# EAGLE design nes_snes_simple (EAGLE 6.4)
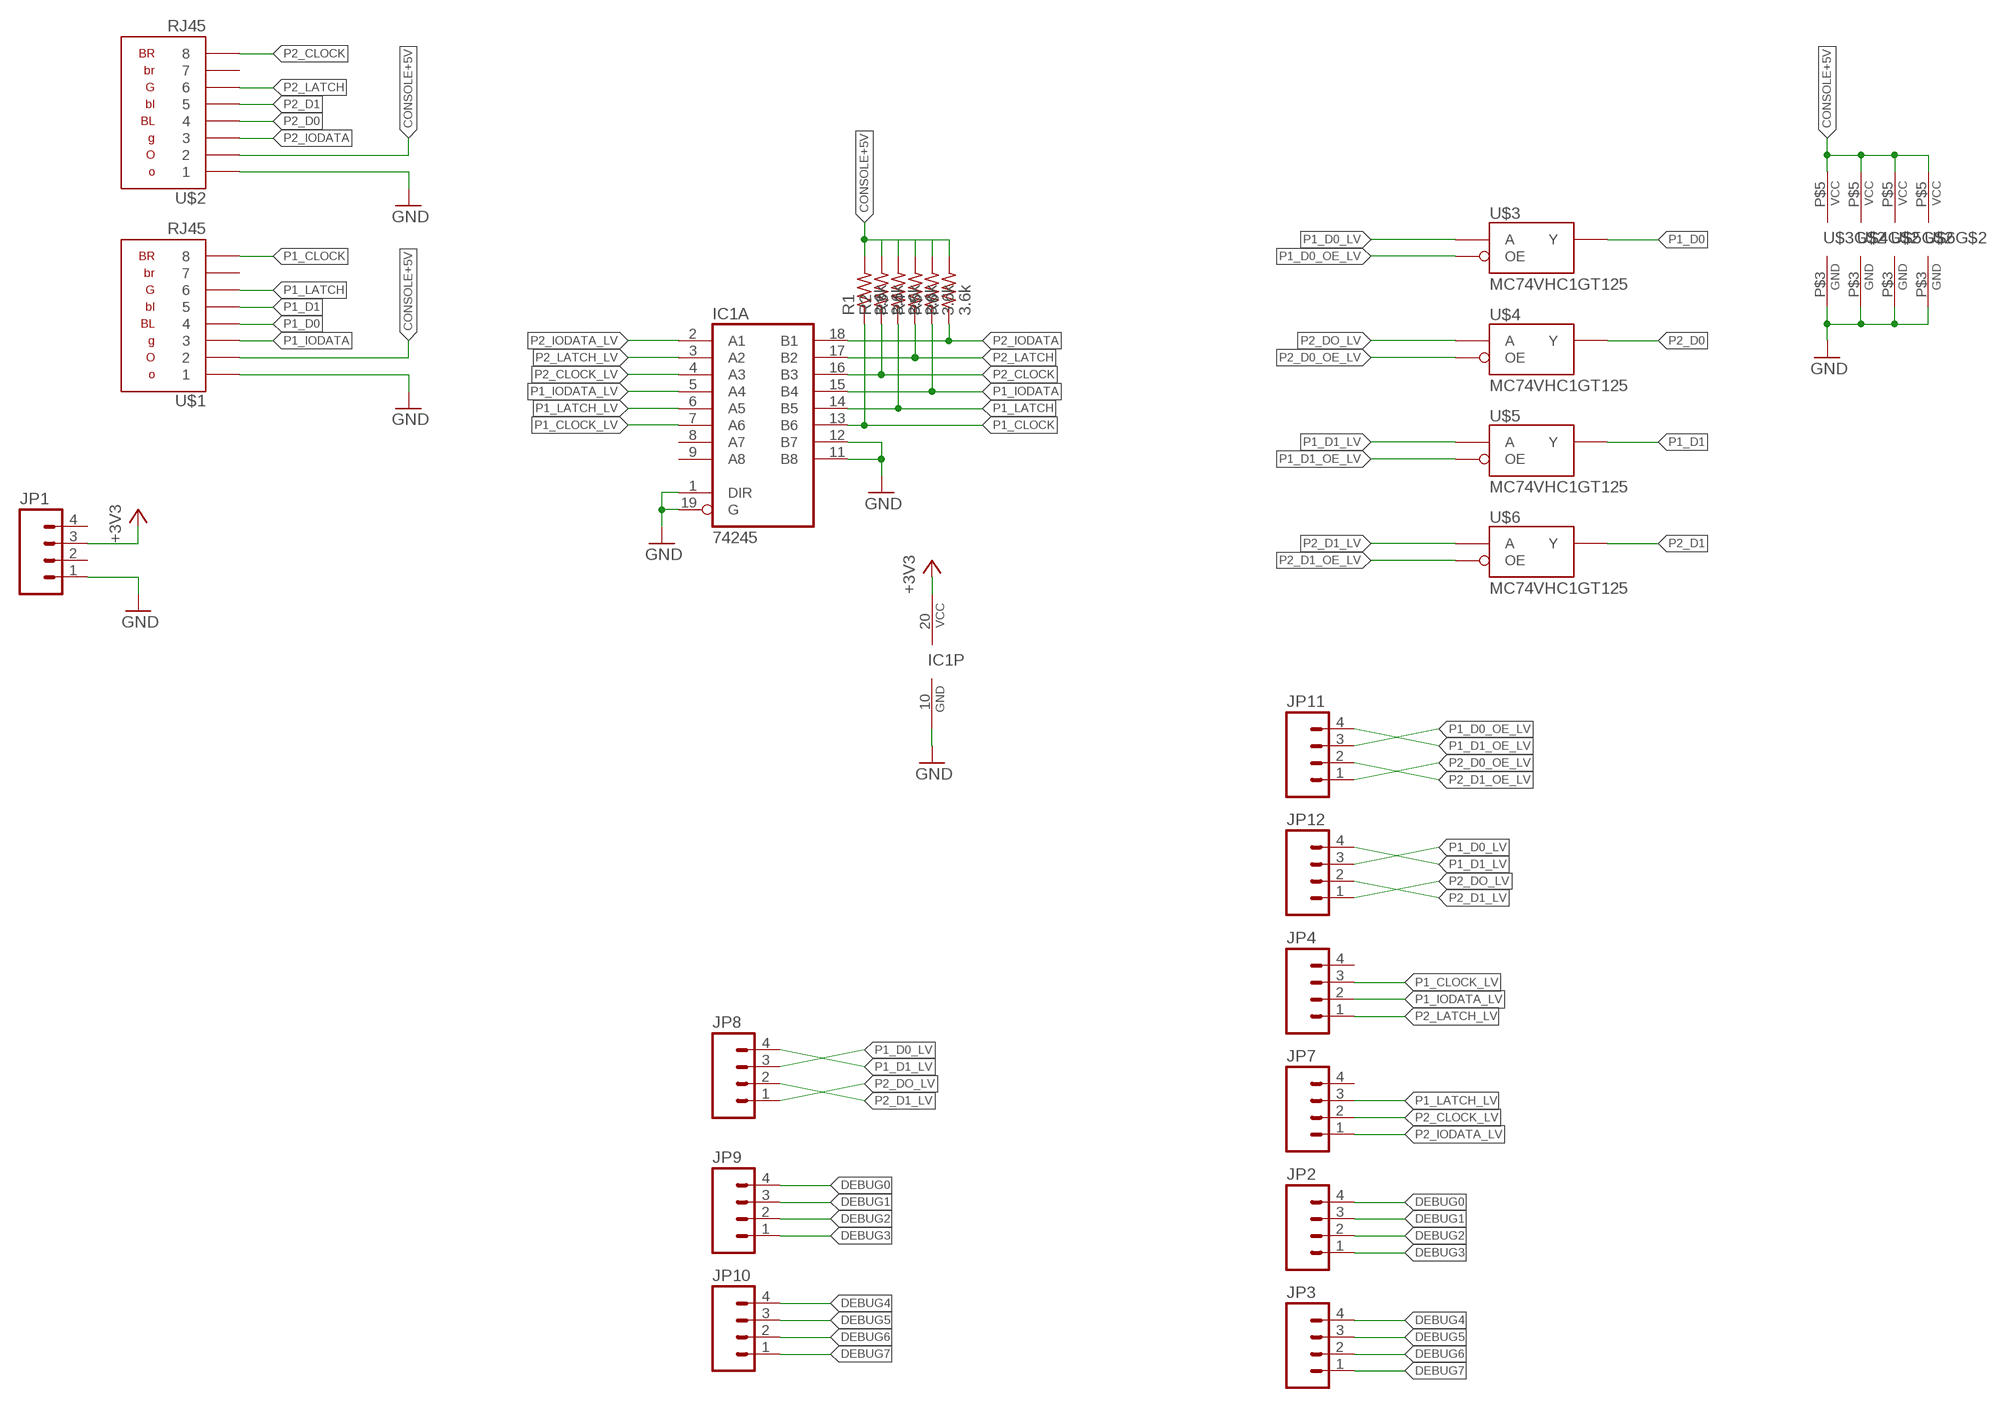
[diagram p0: schematic, sheet 1]

## Parts
IC1  74245  [DIL20]
JP1  M04PTH  [1X04]
JP2  M04PTH  [1X04]
JP3  M04PTH  [1X04]
JP4  M04PTH  [1X04]
JP7  M04PTH  [1X04]
JP8  M04PTH  [1X04]
JP9  M04PTH  [1X04]
JP10  M04PTH  [1X04]
JP11  M04PTH  [1X04]
JP12  M04PTH  [1X04]
R1  3.6k  R-US_0207/2V  [0207/2V]
R2  3.6k  R-US_0207/2V  [0207/2V]
R3  3.6k  R-US_0207/2V  [0207/2V]
R4  3.6k  R-US_0207/2V  [0207/2V]
R5  3.6k  R-US_0207/2V  [0207/2V]
R6  3.6k  R-US_0207/2V  [0207/2V]
U$1  RJ45  [RJ45]
U$2  RJ45  [RJ45]
U$3  MC74VHC1GT125  [TSOP-5]
U$4  MC74VHC1GT125  [TSOP-5]
U$5  MC74VHC1GT125  [TSOP-5]
U$6  MC74VHC1GT125  [TSOP-5]

## Nets
+3V3: IC1.20(VCC) JP1.3
CONSOLE+5V: R1.2 R2.2 R3.2 R4.2 R5.2 R6.2 U$1.2 U$2.2 U$3.P$5(VCC) U$4.P$5(VCC) U$5.P$5(VCC) U$6.P$5(VCC)
DEBUG0: JP2.4 JP9.4
DEBUG1: JP2.3 JP9.3
DEBUG2: JP2.2 JP9.2
DEBUG3: JP2.1 JP9.1
DEBUG4: JP3.4 JP10.4
DEBUG5: JP3.3 JP10.3
DEBUG6: JP3.2 JP10.2
DEBUG7: JP3.1 JP10.1
GND: IC1.1(DIR) IC1.10(GND) IC1.11(B8) IC1.12(B7) IC1.19(G) JP1.1 U$1.1 U$2.1 U$3.P$3(GND) U$4.P$3(GND) U$5.P$3(GND) U$6.P$3(GND)
P1_CLOCK: IC1.13(B6) R1.1 U$1.8
P1_CLOCK_LV: IC1.7(A6) JP4.3
P1_D0: U$1.4 U$3.P$4(Y)
P1_D0_LV: JP8.3 JP12.3 U$3.P$2(A)
P1_D0_OE_LV: JP11.3 U$3.P$1(OE)
P1_D1: U$1.5 U$5.P$4(Y)
P1_D1_LV: JP8.4 JP12.4 U$5.P$2(A)
P1_D1_OE_LV: JP11.4 U$5.P$1(OE)
P1_IODATA: IC1.15(B4) R5.1 U$1.3
P1_IODATA_LV: IC1.5(A4) JP4.2
P1_LATCH: IC1.14(B5) R3.1 U$1.6
P1_LATCH_LV: IC1.6(A5) JP7.3
P2_CLOCK: IC1.16(B3) R2.1 U$2.8
P2_CLOCK_LV: IC1.4(A3) JP7.2
P2_D0: U$2.4 U$4.P$4(Y)
P2_D0_OE_LV: JP11.1 U$4.P$1(OE)
P2_D1: U$2.5 U$6.P$4(Y)
P2_D1_LV: JP8.2 JP12.2 U$6.P$2(A)
P2_D1_OE_LV: JP11.2 U$6.P$1(OE)
P2_DO_LV: JP8.1 JP12.1 U$4.P$2(A)
P2_IODATA: IC1.18(B1) R6.1 U$2.3
P2_IODATA_LV: IC1.2(A1) JP7.1
P2_LATCH: IC1.17(B2) R4.1 U$2.6
P2_LATCH_LV: IC1.3(A2) JP4.1
Unconnected: IC1.8(A7) IC1.9(A8) JP1.2 JP1.4 JP4.4 JP7.4 U$1.7 U$2.7

## Library data of the parts
IC1 = TASLink:74245
JP1-JP4 JP7-JP12 = SparkFun-Connectors:M04: Header 4 Standard 4-pin 0.1" header. Use with straight break away headers (SKU : PRT-00116), right angle break away headers (PRT-00553), swiss pins (PRT-00743), machine pins (PRT-00117), and female headers (PRT-00115). Molex polarized connector foot print use with SKU : PRT-08231 with associated crimp pins and housings. 1MM SMD Version SKU: PRT-10208
R1-R6 = rcl:R-US_: RESISTOR, American symbol
U$1 U$2 = TASLink:RJ45
U$3-U$6 = TASLink:MC74VHC1GT125

## Board
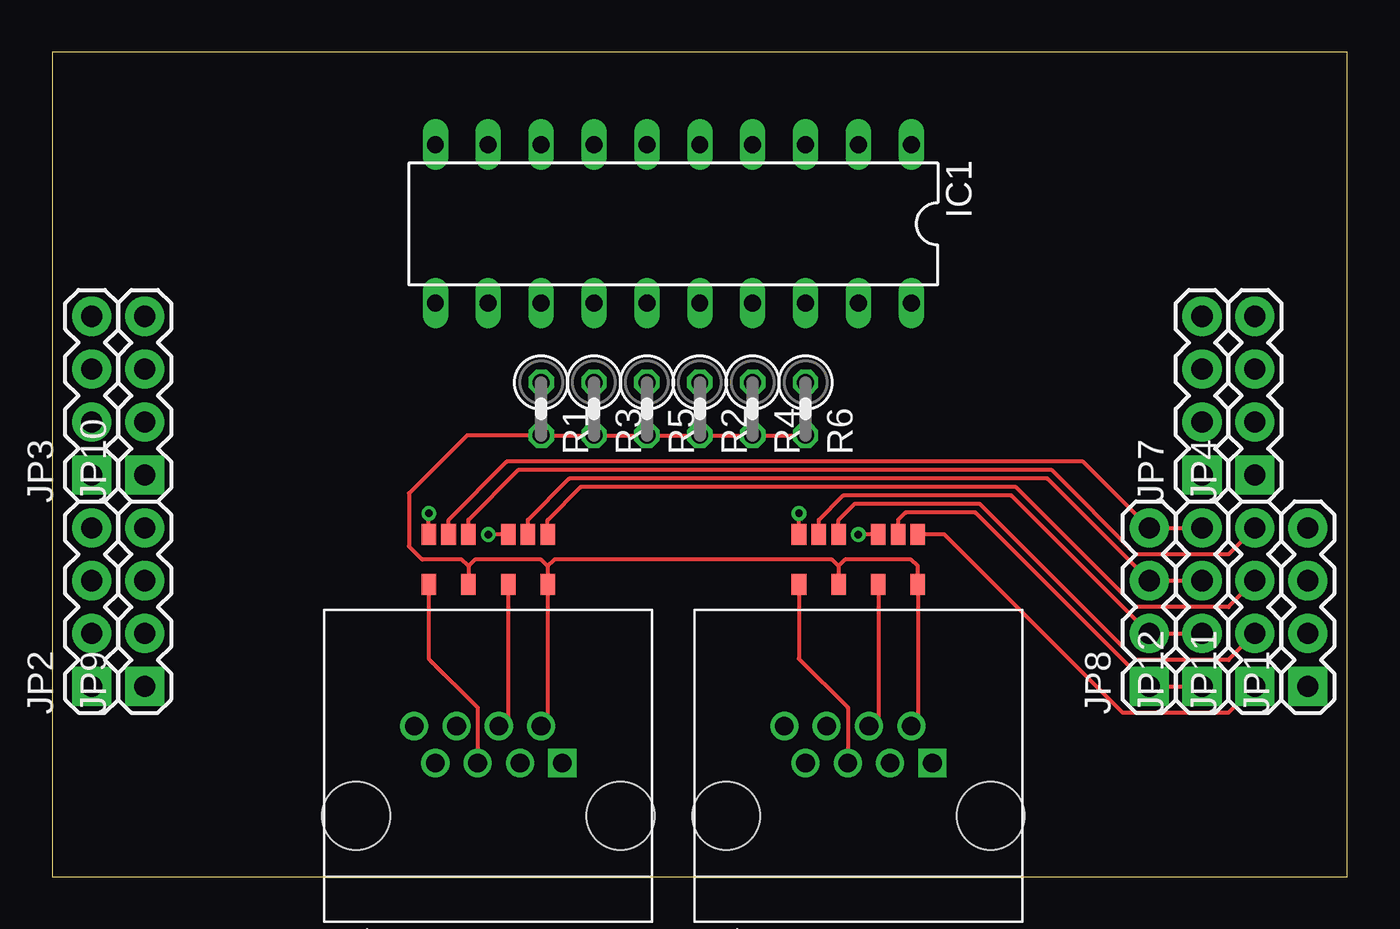
[diagram p1: board, top side]
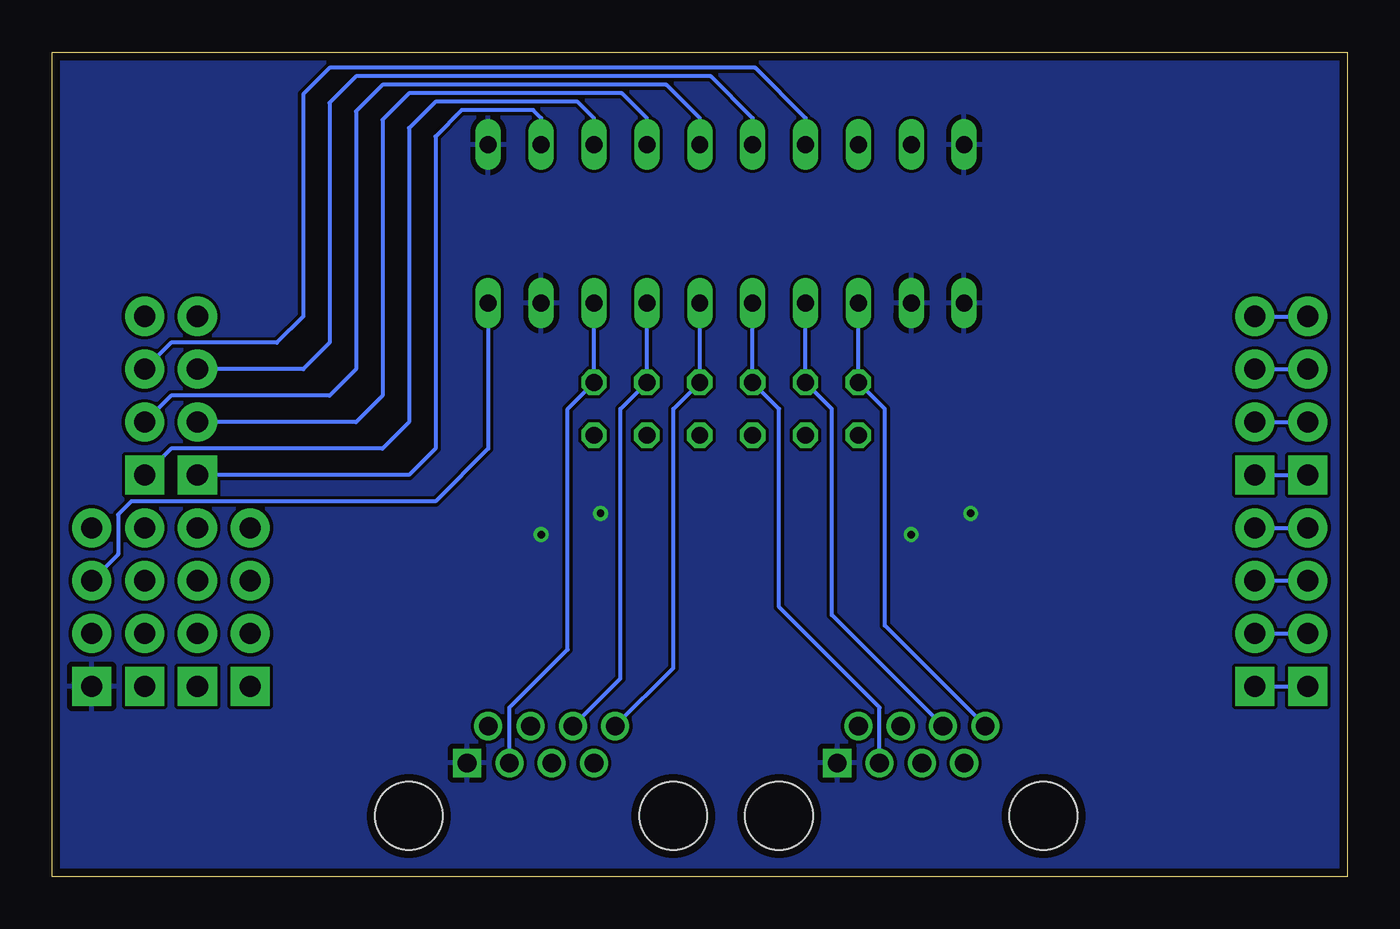
[diagram p2: board, bottom side, seen from below]

Size 62.23 x 39.62 mm. Coordinates in mm from the lower left corner, seen from the top.
Outline: 0,0 62.23,0 62.23,39.62 0,39.62 0,0
Copper layers (1*16): Top 0.0356mm / dielectric 1.5011mm / Bottom 0.0356mm
Design rules "LaenPCBOrder *": minimum track width 6mil, minimum drill 13mil, track to track 6mil, track to pad 6mil, pad to pad 6mil, via to via 6mil, smd to smd 6mil, copper to edge 15mil, drill to drill 6mil, minimum pad ring 7mil, minimum via ring 7mil, stop-mask expansion 3mil, vias tented up to drill 0mil, thermal gap 10mil

### Footprints (pad centres in the part's own frame; a part is rotated, then mirrored left to right if it is on the bottom)
DIL20 = drill 0.813 long: 1 -11.43,-3.81; 2 -8.89,-3.81; 3 -6.35,-3.81; 4 -3.81,-3.81; 5 -1.27,-3.81; 6 1.27,-3.81; 7 3.81,-3.81; 8 6.35,-3.81; 9 8.89,-3.81; 10 11.43,-3.81; 11 11.43,3.81; 12 8.89,3.81; 13 6.35,3.81; 14 3.81,3.81; 15 1.27,3.81; 16 -1.27,3.81; 17 -3.81,3.81; 18 -6.35,3.81; 19 -8.89,3.81; 20 -11.43,3.81
1X04 = drill 1.016 pad 1.88 square: 1 0,0 | drill 1.016 pad 1.88: 2 2.54,0; 3 5.08,0; 4 7.62,0
0207/2V = drill 0.813 octagon: 1 -1.27,0; 2 1.27,0
RJ45 = drill 0.9 square: 1 3.556,-0.889 | drill 0.9: 2 2.54,0.889; 3 1.524,-0.889; 4 0.508,0.889; 5 -0.508,-0.889; 6 -1.524,0.889; 7 -2.54,-0.889; 8 -3.556,0.889 | hole 3.251: -6.35,-3.429; 6.35,-3.429
TSOP-5 = smd 0.7 x 1: P$1 0.95,1.2; P$2 0,1.2; P$3 -0.95,1.2; P$4 -0.95,-1.2; P$5 0.95,-1.2

### Placement (x,y rotation side)
IC1  29.84,31.37 180 top
JP1  60.33,9.14 90 top
JP2  1.91,9.14 90 top
JP3  1.91,19.3 90 top
JP4  57.78,19.3 90 top
JP7  55.24,19.3 90 top
JP8  52.7,9.14 90 top
JP9  4.45,9.14 90 top
JP10  4.45,19.3 90 top
JP11  57.78,9.14 90 top
JP12  55.24,9.14 90 top
R1  23.5,22.48 270 top
R2  31.11,22.48 270 top
R3  26.04,22.48 270 top
R4  33.66,22.48 270 top
R5  28.57,22.48 270 top
R6  36.2,22.48 270 top
U$1  20.95,6.35 0 top
U$2  38.73,6.35 0 top
U$3  22.86,15.24 0 top
U$4  40.64,15.24 0 top
U$5  19.05,15.24 0 top
U$6  36.83,15.24 0 top

### Tracks (layer width: path | path; a pad name or v marks a point on that pad's centre or on a via)
+3V3
  Bottom 0.203: IC1.20 41.27,20.57 43.81,18.03 58.42,18.03 59.05,17.4 59.05,15.49 JP1.3
CONSOLE+5V
  Top 0.203: R6.2 R4.2 R2.2 R5.2 R3.2 R1.2 19.94,21.21 17.14,18.41 17.14,15.88 17.78,15.24 19.68,15.24 20,14.92 | 23.81,14.92 23.49,15.24 20.32,15.24 20,14.92 | 37.78,14.92 38.1,15.24 41.27,15.24 41.59,14.92 U$4.P$5 41.59,7.55 U$2.2 | 20,14.92 U$5.P$5 | U$1.2 23.81,7.55 U$3.P$5 23.81,14.92 | 23.81,14.92 24.13,15.24 37.46,15.24 37.78,14.92 | 37.78,14.92 U$6.P$5
DEBUG0
  Bottom 0.203: JP9.4 JP2.4
DEBUG1
  Bottom 0.203: JP9.3 JP2.3
DEBUG2
  Bottom 0.203: JP9.2 JP2.2
DEBUG3
  Bottom 0.203: JP9.1 JP2.1
DEBUG4
  Bottom 0.203: JP10.4 JP3.4
DEBUG5
  Bottom 0.203: JP10.3 JP3.3
DEBUG6
  Bottom 0.203: JP10.2 JP3.2
DEBUG7
  Bottom 0.203: JP10.1 JP3.1
GND  (via drill 0.36)
  Top 0.203: U$4.P$3 v38.73,16.44 | U$6.P$3 v35.88,17.46 | U$3.P$3 v20.95,16.44 | U$5.P$3 v18.1,17.46
  pour Bottom: 0,39.62 62.23,39.62 62.23,0 0,0
P1_CLOCK
  Bottom 0.203: IC1.13 R1.1 22.23,22.48 22.23,12.06 U$1.8
P1_CLOCK_LV
  Bottom 0.203: JP4.3 56.52,25.65 51.44,25.65 50.16,26.92 50.16,37.59 48.9,38.86 28.45,38.86 26.04,36.45 IC1.7
P1_D0
  Top 0.203: U$3.P$4 21.91,7.69 U$1.4
P1_D0_LV
  Top 0.203: JP12.3 JP8.3 47.8,19.13 24.84,19.13 22.86,17.14 U$3.P$2
P1_D0_OE_LV
  Top 0.203: U$3.P$1 23.81,17.14 23.82,17.14 25.4,18.72 46.3,18.72 52.07,12.95 56.52,12.95 JP11.3
P1_D1
  Top 0.203: U$5.P$4 18.1,10.47 20.45,8.13 U$1.5
P1_D1_LV
  Top 0.203: JP12.4 JP8.4 49.53,19.94 21.84,19.94 19.05,17.14 U$5.P$2
P1_D1_OE_LV
  Top 0.203: JP11.4 56.52,15.49 52.07,15.49 48.03,19.53 22.39,19.53 20,17.14 U$5.P$1
P1_IODATA
  Bottom 0.203: IC1.15 R5.1 27.3,22.48 27.3,12.95 22.48,8.13 U$1.3
P1_IODATA_LV
  Bottom 0.203: JP4.2 56.52,23.11 48.9,23.11 47.62,24.38 47.62,36.78 46.35,38.05 32.72,38.05 31.11,36.45 IC1.5
P1_LATCH
  Bottom 0.203: IC1.14 R3.1 24.77,22.48 24.77,12.57 U$1.6
P1_LATCH_LV
  Bottom 0.203: JP7.3 50.16,24.38 48.9,25.65 48.9,37.19 47.62,38.46 30.58,38.46 28.57,36.45 IC1.6
P2_CLOCK
  Bottom 0.203: IC1.16 R2.1 32.38,22.48 32.38,10.03 U$2.8
P2_CLOCK_LV
  Bottom 0.203: JP7.2 47.62,21.84 46.35,23.11 46.35,36.37 45.09,37.64 34.85,37.64 33.66,36.45 IC1.4
P2_D0
  Top 0.203: U$4.P$4 39.69,7.69 U$2.4
P2_D0_OE_LV
  Top 0.203: JP11.1 56.52,7.87 51.44,7.87 42.87,16.44 U$4.P$1
P2_D1
  Top 0.203: U$6.P$4 35.88,10.47 38.23,8.13 U$2.5
P2_D1_LV
  Top 0.203: JP12.2 JP8.2 46.08,18.31 38,18.31 36.83,17.14 U$6.P$2
P2_D1_OE_LV
  Top 0.203: JP11.2 56.52,10.41 52.07,10.41 44.58,17.91 38.54,17.91 37.78,17.14 U$6.P$1
P2_DO_LV
  Top 0.203: JP12.1 JP8.1 44.35,17.5 41,17.5 40.64,17.14 U$4.P$2
P2_IODATA
  Bottom 0.203: IC1.18 R6.1 37.47,22.48 37.47,10.92 40.26,8.13 U$2.3
P2_IODATA_LV
  Bottom 0.203: JP7.1 45.09,19.3 43.81,20.57 43.81,35.56 42.55,36.83 39.12,36.83 38.73,36.45 IC1.2
P2_LATCH
  Bottom 0.203: IC1.17 R4.1 34.92,22.48 34.92,9.53 U$2.6
P2_LATCH_LV
  Bottom 0.203: JP4.1 56.52,20.57 46.35,20.57 45.09,21.84 45.09,35.97 43.81,37.24 36.98,37.24 36.2,36.45 IC1.3